# Altium schematic sheet Sheet2.SchDoc
size A4; SheetNumber: 1; SheetTotal: 1
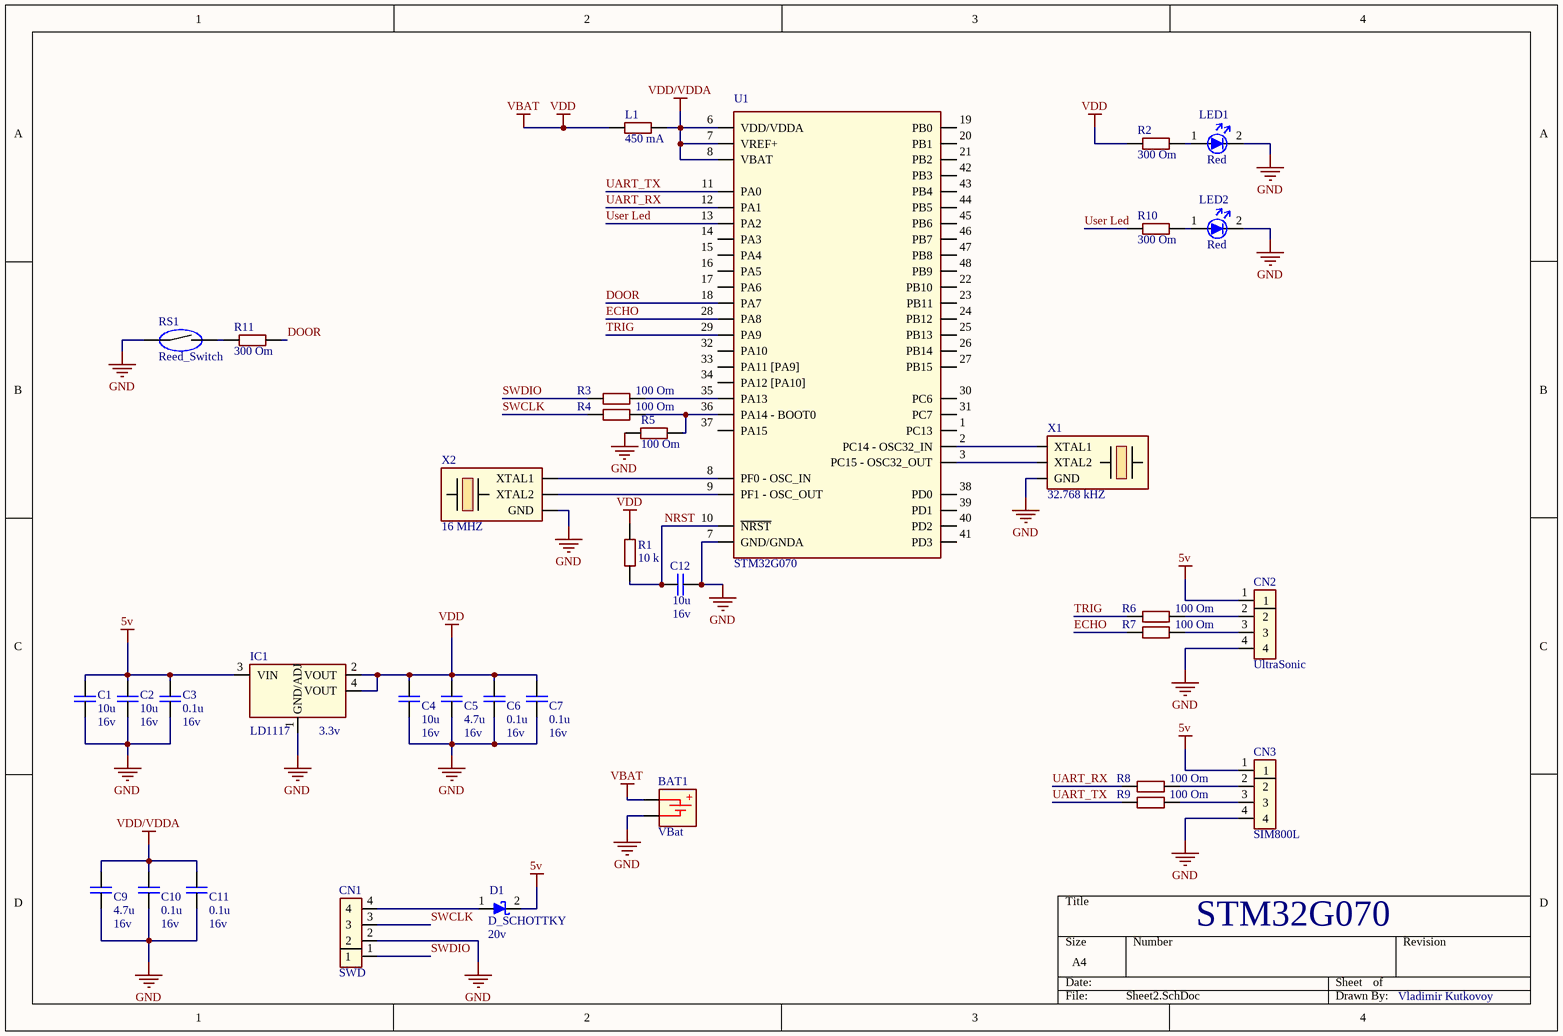
[diagram p0: Sheet2.SchDoc]

## Parts
BAT1  VBat  [Vbat]
C1  Сapacity: 10u  Voltage: 16v  [Capacitor_smd_0863]  (hidden comment: Capacitor)
C2  Сapacity: 10u  Voltage: 16v  [Capacitor_smd_0863]  (hidden comment: Capacitor)
C3  Сapacity: 0.1u  Voltage: 16v  [Capacitor_smd_0863]  (hidden comment: Capacitor)
C4  Сapacity: 10u  Voltage: 16v  [Capacitor_smd_0863]  (hidden comment: Capacitor)
C5  Сapacity: 4.7u  Voltage: 16v  [Capacitor_smd_0863]  (hidden comment: Capacitor)
C6  Сapacity: 0.1u  Voltage: 16v  [Capacitor_smd_0863]  (hidden comment: Capacitor)
C7  Сapacity: 0.1u  Voltage: 16v  [Capacitor_smd_0863]  (hidden comment: Capacitor)
C9  Сapacity: 4.7u  Voltage: 16v  [Capacitor_smd_0863]  (hidden comment: Capacitor)
C10  Сapacity: 0.1u  Voltage: 16v  [Capacitor_smd_0863]  (hidden comment: Capacitor)
C11  Сapacity: 0.1u  Voltage: 16v  [Capacitor_smd_0863]  (hidden comment: Capacitor)
C12  Сapacity: 10u  Voltage: 16v  [Capacitor_smd_0863]  (hidden comment: Capacitor)
CN1  SWD  [Connector_Prog]
CN2  UltraSonic  [Connector_Prog]
CN3  SIM800L  [Connector_Prog]
D1  D_SCHOTTKY  Voltage: 20v  [Diod_Shottky]
IC1  LD1117  Voltage: 3.3v  [LD1117]
L1  450 mA  [Resistor_smd_0603]
LED1  Red  [Led_smd_0603_Red]
LED2  Red  [Led_smd_0603_Red]
R1  10 k  [Resistor_smd_0603]
R2  300 Om  [Resistor_smd_0603]
R3  100 Om  [Resistor_smd_0603]
R4  100 Om  [Resistor_smd_0603]
R5  100 Om  [Resistor_smd_0603]
R6  100 Om  [Resistor_smd_0603]
R7  100 Om  [Resistor_smd_0603]
R8  100 Om  [Resistor_smd_0603]
R9  100 Om  [Resistor_smd_0603]
R10  300 Om  [Resistor_smd_0603]
R11  300 Om  [Resistor_smd_0603]
RS1  Reed_Switch  [Vbat]
U1  STM32G070  [STM32G070]
X1  32.768 kHZ
X2  16 MHZ

## Nets
5v: C1.1 C2.1 C3.1 CN2.1 CN3.1 D1.2 IC1.3(VIN)
GND: BAT1.2(GND) C1.2 C2.2 C3.2 C4.1 C5.1 C6.1 C7.1 C9.1 C10.1 C11.1 C12.1 CN1.2 CN2.4 CN3.4 IC1.1(GND/ADJ) LED1.2 LED2.2 R5.1 RS1.1 U1.7(GND/GNDA) X1.3(GND) X2.3(GND)
VBAT: BAT1.1(VCC) C4.2 C5.2 C6.2 C7.2 IC1.2(VOUT) IC1.4(VOUT) L1.1 R1.2 R2.1  [also labelled VDD]
VDD/VDDA: C9.2 C10.2 C11.2 L1.2 U1.6(VDD/VDDA) U1.7(VREF+) U1.8(VBAT)
DOOR: R11.2 U1.18(PA7)
ECHO: R7.1 U1.28(PA8)
NRST: C12.2 R1.1 U1.10(~{NRST})
SWCLK: CN1.3 R4.1
SWDIO: CN1.1 R3.1
TRIG: R6.1 U1.29(PA9)
UART_RX: R8.1 U1.12(PA1)
UART_TX: R9.1 U1.11(PA0)
User Led: R10.1 U1.13(PA2)
NetCN1_4: CN1.4 D1.1
NetCN2_2: CN2.2 R6.2
NetCN2_3: CN2.3 R7.2
NetCN3_2: CN3.2 R8.2
NetCN3_3: CN3.3 R9.2
NetLED1_1: LED1.1 R2.2
NetLED2_1: LED2.1 R10.2
NetR3_2: R3.2 U1.35(PA13)
NetR4_2: R4.2 R5.2 U1.36(PA14_-_BOOT0)
NetR11_1: R11.1 RS1.2
NetU1_2: U1.2(PC14_-_OSC32_IN) X1.1(XTAL1)
NetU1_3: U1.3(PC15_-_OSC32_OUT) X1.2(XTAL2)
NetU1_8: U1.8(PF0_-_OSC_IN) X2.1(XTAL1)
NetU1_9: U1.9(PF1_-_OSC_OUT) X2.2(XTAL2)

Not connected (* = marked no-connect by the designer): U1 1(PС13) 14(PA3) 15(PA4) 16(PA5) 17(PA6) 19(PB0) 20(PB1) 21(PB2) 22(PB10) 23(PB11) 24(PB12) 25(PB13) 26(PB14) 27(PB15) 30(PС6) 31(PС7) 32(PA10) 33(PA11_[PA9]) 34(PA12_[PA10]) 37(PA15) 38(PD0) 39(PD1) 40(PD2) 41(PD3) 42(PB3) 43(PB4) 44(PB5) 45(PB6) 46(PB7) 47(PB8) 48(PB9)

## Notes on the sheet
- STM32G070
- Vladimir Kutkovoy
- (in symbol VBat) +

## Library data of the parts
CN1-CN3 = Connector_programming
D1 = Diod_Shottky
L1 = Filter
LED1 LED2 = LED
R1-R11 = Resistor
X1 = XTAL
X2 = XTAL_RightPin